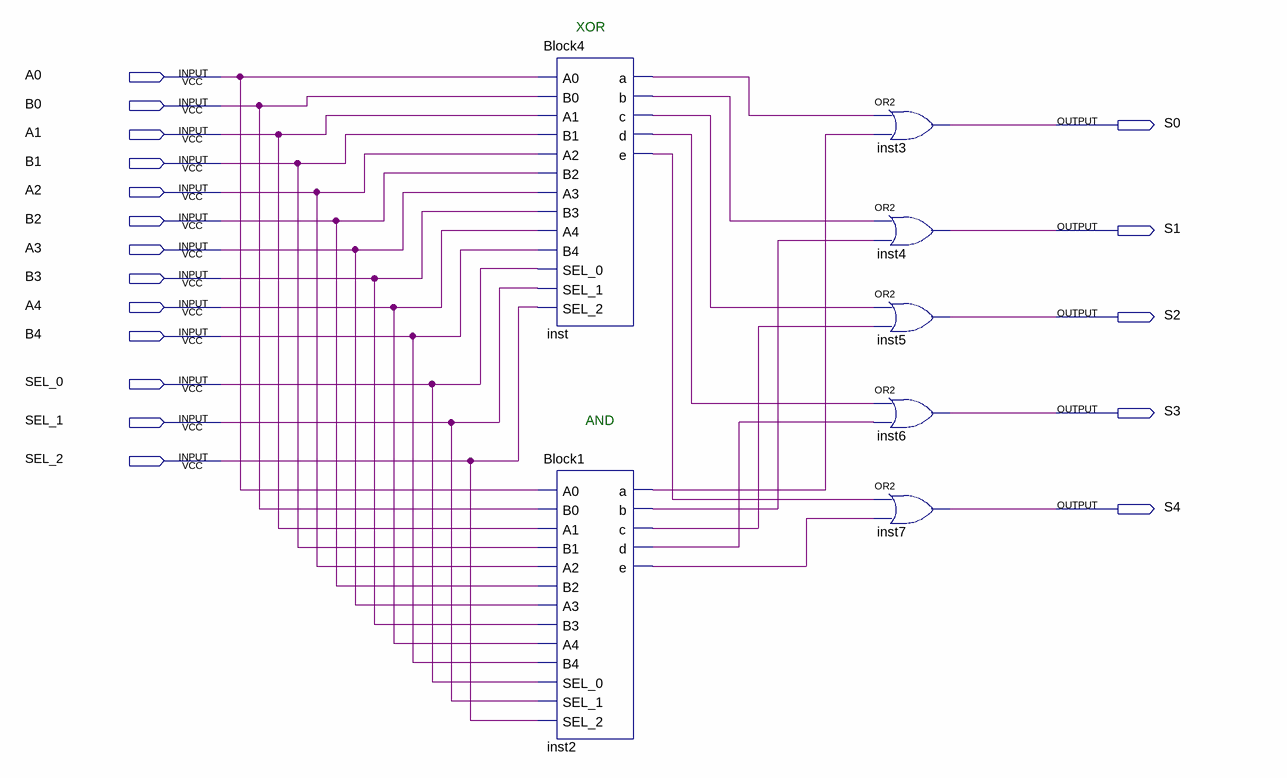
[diagram p0: schematic sheet]
// Quartus schematic AND_E_XOR.bdf as structural Verilog: 7 symbols, 18 pins
module AND_E_XOR (
  input  A0,
  input  B0,
  input  A1,
  input  B1,
  input  A2,
  input  B2,
  input  A3,
  input  B3,
  input  A4,
  input  B4,
  input  SEL_0,
  input  SEL_1,
  input  SEL_2,
  output S0,
  output S1,
  output S2,
  output S3,
  output S4
);

  wire inst2_a, inst2_b, inst2_c, inst2_d, inst2_e, inst_a, inst_b, inst_c, inst_d, inst_e;

  Block4 inst (
    .A0(A0), .B0(B0), .A1(A1), .B1(B1), .A2(A2), .B2(B2), .A3(A3), .B3(B3), .A4(A4), .B4(B4), .SEL_0(SEL_0),
    .SEL_1(SEL_1), .SEL_2(SEL_2), .a(inst_a), .b(inst_b), .c(inst_c), .d(inst_d), .e(inst_e));
  Block1 inst2 (
    .A0(A0), .B0(B0), .A1(A1), .B1(B1), .A2(A2), .B2(B2), .A3(A3), .B3(B3), .A4(A4), .B4(B4), .SEL_0(SEL_0),
    .SEL_1(SEL_1), .SEL_2(SEL_2), .a(inst2_a), .b(inst2_b), .c(inst2_c), .d(inst2_d), .e(inst2_e));
  or inst3 (S0, inst_a, inst2_a);
  or inst4 (S1, inst_b, inst2_b);
  or inst5 (S2, inst_c, inst2_c);
  or inst6 (S3, inst_d, inst2_d);
  or inst7 (S4, inst_e, inst2_e);

  // Notes on the sheet:
  //   XOR
  //   AND
endmodule
